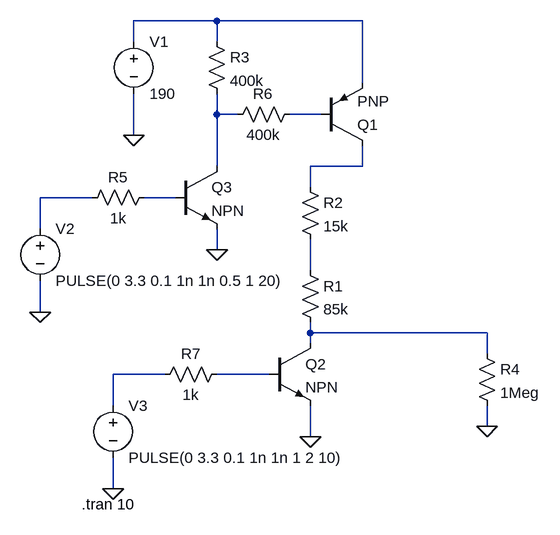
[diagram p0: schematic Nixie Driver.asc]
Nixie Driver.asc, the LTspice schematic file:
Version 4.1
SHEET 1 880 680
WIRE -16 -240 -144 -240
WIRE 208 -240 -16 -240
WIRE -144 -208 -144 -240
WIRE -16 -208 -16 -240
WIRE 208 -144 208 -240
WIRE -16 -96 -16 -128
WIRE 16 -96 -16 -96
WIRE 144 -96 96 -96
WIRE -144 -64 -144 -128
WIRE -16 -16 -16 -96
WIRE 208 -16 208 -48
WIRE 208 -16 128 -16
WIRE 128 16 128 -16
WIRE -208 32 -288 32
WIRE -80 32 -128 32
WIRE -288 80 -288 32
WIRE -16 112 -16 80
WIRE 128 144 128 96
WIRE -288 208 -288 160
WIRE 128 240 128 224
WIRE 400 240 128 240
WIRE 128 256 128 240
WIRE 400 272 400 240
WIRE -96 304 -176 304
WIRE 64 304 -16 304
WIRE -176 352 -176 304
WIRE 400 384 400 352
WIRE 128 400 128 352
WIRE -176 480 -176 432
FLAG 128 400 0
FLAG -144 -64 0
FLAG -16 112 0
FLAG -288 208 0
FLAG -176 480 0
FLAG 400 384 0
SYMBOL pnp 144 -48 M180
SYMATTR InstName Q1
SYMBOL npn 64 256 R0
SYMATTR InstName Q2
SYMBOL res 112 128 R0
SYMATTR InstName R1
SYMATTR Value 85k
SYMBOL res 112 0 R0
SYMATTR InstName R2
SYMATTR Value 15k
SYMBOL voltage -144 -224 R0
WINDOW 123 0 0 Left 0
WINDOW 39 0 0 Left 0
SYMATTR InstName V1
SYMATTR Value 190
SYMBOL npn -80 -16 R0
SYMATTR InstName Q3
SYMBOL res -32 -224 R0
SYMATTR InstName R3
SYMATTR Value 400k
SYMBOL voltage -288 64 R0
WINDOW 123 0 0 Left 0
WINDOW 39 0 0 Left 0
SYMATTR InstName V2
SYMATTR Value PULSE(0 3.3 0.1 1n 1n 0.5 1 20)
SYMBOL voltage -176 336 R0
WINDOW 123 0 0 Left 0
WINDOW 39 0 0 Left 0
SYMATTR InstName V3
SYMATTR Value PULSE(0 3.3 0.1 1n 1n 1 2 10)
SYMBOL res 384 256 R0
SYMATTR InstName R4
SYMATTR Value 1Meg
SYMBOL res -112 16 R90
WINDOW 0 0 56 VBottom 2
WINDOW 3 32 56 VTop 2
SYMATTR InstName R5
SYMATTR Value 1k
SYMBOL res 112 -112 R90
WINDOW 0 0 57 VBottom 2
WINDOW 3 32 56 VTop 2
SYMATTR InstName R6
SYMATTR Value 400k
SYMBOL res 0 288 R90
WINDOW 0 0 56 VBottom 2
WINDOW 3 32 56 VTop 2
SYMATTR InstName R7
SYMATTR Value 1k
TEXT -224 504 Left 2 !.tran 10

The netlist it stands for:
* Nixie Driver.asc
Q1 N004 N003 N001 0 PNP
Q2 N008 N010 0 0 NPN
R1 N007 N008 85k
R2 N004 N007 15k
V1 N001 0 190
Q3 N002 N006 0 0 NPN
R3 N001 N002 400k
V2 N005 0 PULSE(0 3.3 0.1 1n 1n 0.5 1 20)
V3 N009 0 PULSE(0 3.3 0.1 1n 1n 1 2 10)
R4 N008 0 1Meg
R5 N006 N005 1k
R6 N003 N002 400k
R7 N010 N009 1k
.model NPN NPN
.model PNP PNP
.lib standard.bjt
.tran 10
.backanno
.end